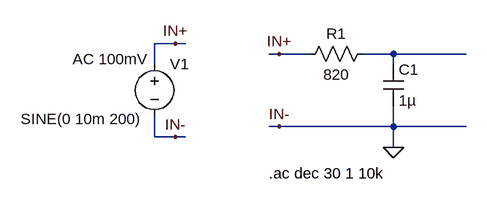
[diagram p0: schematic RC.asc]
RC.asc, the LTspice schematic file:
Version 4
SHEET 1 880 680
WIRE -224 96 -256 96
WIRE -208 96 -224 96
WIRE -64 112 -80 112
WIRE -16 112 -64 112
WIRE 112 112 64 112
WIRE 224 112 112 112
WIRE -256 128 -256 96
WIRE 112 128 112 112
WIRE -64 224 -80 224
WIRE 112 224 112 192
WIRE 112 224 -64 224
WIRE 224 224 112 224
WIRE -256 240 -256 208
WIRE -224 240 -256 240
WIRE -208 240 -224 240
WIRE 112 256 112 224
FLAG 112 256 0
FLAG -64 112 IN+
FLAG -64 224 IN-
FLAG -224 240 IN-
FLAG -224 96 IN+
SYMBOL res 80 96 R90
WINDOW 0 0 56 VBottom 2
WINDOW 3 32 56 VTop 2
SYMATTR InstName R1
SYMATTR Value 820
SYMBOL cap 96 128 R0
SYMATTR InstName C1
SYMATTR Value 1µ
SYMBOL voltage -256 112 R0
WINDOW 3 -206 100 Left 2
WINDOW 123 -126 8 Left 2
WINDOW 39 0 0 Left 0
SYMATTR InstName V1
SYMATTR Value SINE(0 10m 200)
SYMATTR Value2 AC 100mV
TEXT -80 296 Left 2 !.ac dec 30 1 10k

The netlist it stands for:
* RC.asc
R1 N001 IN+ 820
C1 N001 0 1µ
V1 IN+ 0 SINE(0 10m 200) AC 100mV
.ac dec 30 1 10k
.backanno
.end